# Altium schematic sheet Diode - Rectifer.SchDoc
size A3; SheetNumber: 23; SheetTotal: 40
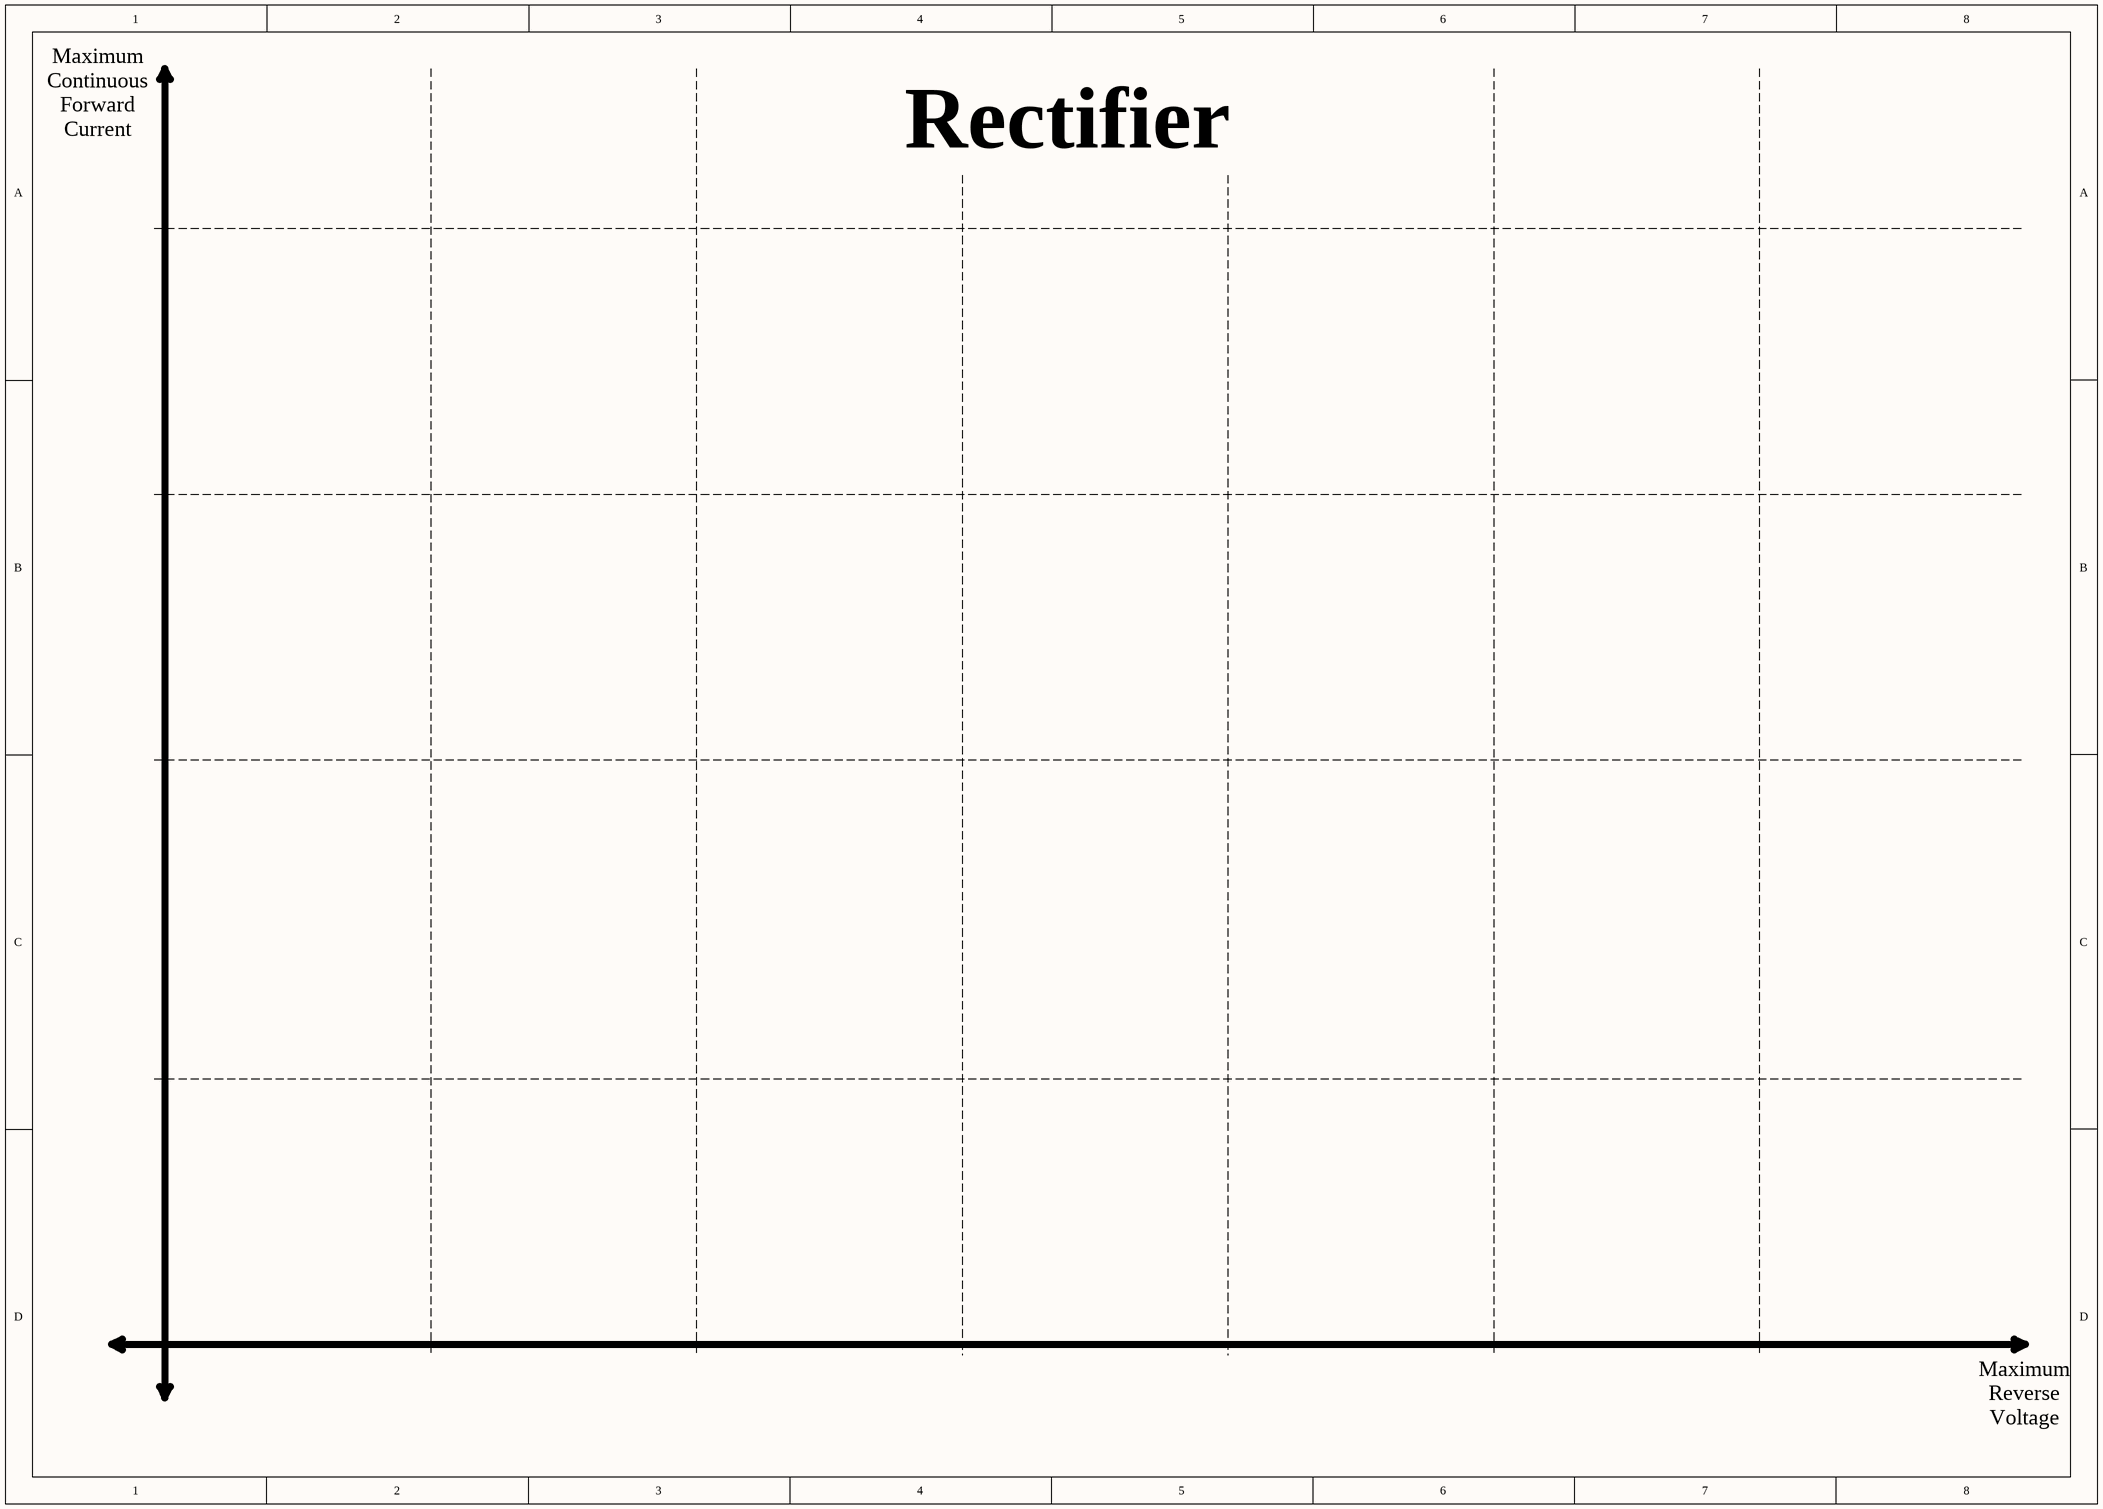
[diagram p0: Diode - Rectifer.SchDoc]

## Notes on the sheet
- Maximum
  Continuous
  Forward
  Current
- Rectifier
- 1000A
- 100A
- 10A
- 1A
- 50V
- 100V
- 200V
- 400V
- 800V
- 1600V
- Maximum
  Reverse
  Voltage